# EAGLE design wicon3d_hw (EAGLE 7.6.0)
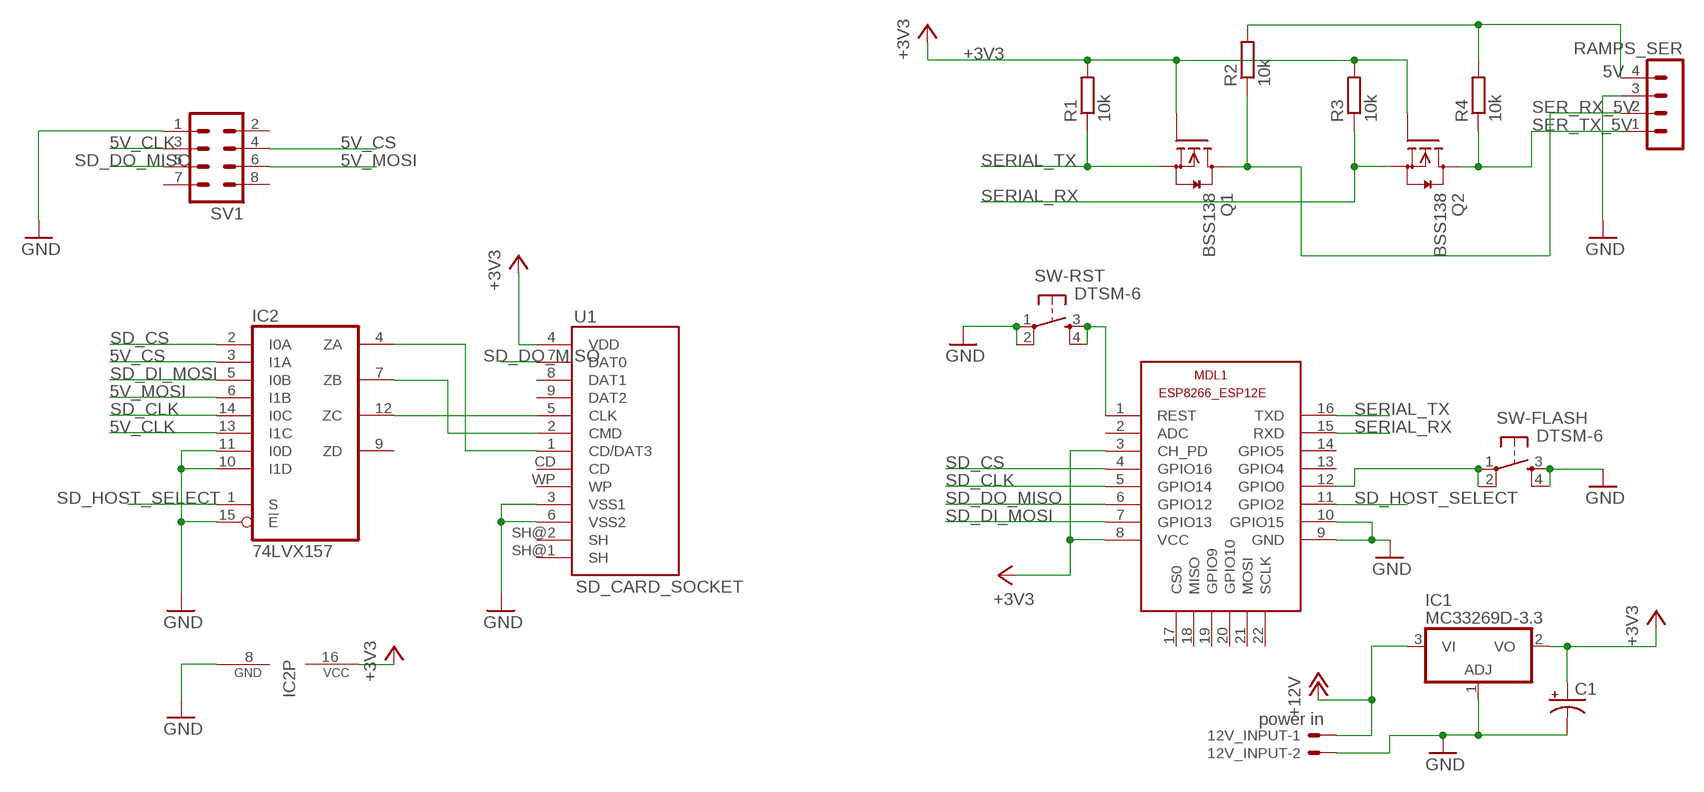
[diagram p0: schematic, sheet 1]

## Parts
12V_INPUT  power in  22-23-2021  [22-23-2021]
C1  47UF-50V-20%(ELECT)  [PANASONIC_D]
IC1  MC33269D-3.3  [DPACK]
IC2  74LVX157  [TSSOP16L]
MDL1  ESP8266-12EESP8266-ESP12E  [ESP8266-ESP12E]
Q1  BSS138  [SOT23]
Q2  BSS138  [SOT23]
R1  10k  R-EU_R0805  [R0805]
R2  10k  R-EU_R0805  [R0805]
R3  10k  R-EU_R0805  [R0805]
R4  10k  R-EU_R0805  [R0805]
RAMPS_SER  MA04-1  [MA04-1]
SV1  MA04-2  [MA04-2]
SW-FLASH  DTSM-6  [DTSM-6]
SW-RST  DTSM-6  [DTSM-6]
U1  SD_CARD_SOCKET  [SD_1:1]

## Nets
5V: R2.2 R4.2 RAMPS_SER.4
5V_CLK: IC2.13(I1C) SV1.3
5V_CS: IC2.3(I1A) SV1.4
5V_MOSI: IC2.6(I1B) SV1.6
+3V3: C1.+ IC1.2(VO) IC2.16(VCC) MDL1.3(CH_PD) MDL1.8(VCC) Q1.1(G) Q2.1(G) R1.2 R3.2 U1.4(VDD)
+12V: 12V_INPUT.1 IC1.3(VI)
CLK: IC2.12(ZC) U1.5(CLK)
CS: IC2.4(ZA) U1.1(CD/DAT3)
GND: 12V_INPUT.2 C1.- IC1.1(ADJ) IC2.8(GND) IC2.10(I1D) IC2.11(I0D) IC2.15(!E) MDL1.9(GND) MDL1.10(GPIO15) RAMPS_SER.3 SV1.1 SW-FLASH.3 SW-FLASH.4 SW-RST.1 SW-RST.2 U1.3(VSS1) U1.6(VSS2)
MOSI: IC2.7(ZB) U1.2(CMD)
N$1: MDL1.1(REST) SW-RST.3 SW-RST.4
N$2: MDL1.12(GPIO0) SW-FLASH.1 SW-FLASH.2
N$5: MDL1.20(GPIO10) MDL1.21(MOSI) MDL1.22(SCLK)
SD_CLK: IC2.14(I0C) MDL1.5(GPIO14)
SD_CS: IC2.2(I0A) MDL1.4(GPIO16)
SD_DI_MOSI: IC2.5(I0B) MDL1.7(GPIO13)
SD_DO_MISO: MDL1.6(GPIO12) SV1.5 U1.7(DAT0)
SD_HOST_SELECT: IC2.1(S) MDL1.11(GPIO2)
SER_RX_5V: Q1.3(D) R2.1 RAMPS_SER.2
SER_TX_5V: Q2.3(D) R4.1 RAMPS_SER.1
SERIAL_RX: MDL1.15(RXD) Q2.2(S) R3.1
SERIAL_TX: MDL1.16(TXD) Q1.2(S) R1.1
Unconnected: IC2.9(ZD) MDL1.2(ADC) MDL1.13(GPIO4) MDL1.14(GPIO5) MDL1.17(CS0) MDL1.18(MISO) MDL1.19(GPIO9) SV1.2 SV1.7 SV1.8 U1.8(DAT1) U1.9(DAT2) U1.CD U1.SH@1(SH) U1.SH@2(SH) U1.WP

## Library data of the parts
12V_INPUT = con-molex:22-23-2021: .100" (2.54mm) Center Header - 2 Pin; MF: MOLEX; MPN: 22-23-2021; OC_FARNELL: 1462926; OC_NEWARK: 25C3832
C1 = SparkFun-Capacitors:47UF-50V-20%(ELECT): CAP-10547; PROD_ID: CAP-10547
IC1 = linear:MC33269?*: Adjustable Output Low Dropout Voltage Regulator 800 mA Source: http://www.onsemi.com/pub/Collateral/MC33269-D.PDF
IC2 = fairchild-semic:74LVX157: Low Voltage Quad 2-Input Multiplexer
MDL1 = ESP12E:ESP8266-12E: ESP8266-12E with additional I/O and GPIO04/05 corrected The author cannot warrant that this library is free from error or will meet your specific requirements. Created by PuceBaboon.com. Komagane, Nagano, JAPAN
Q1 Q2 = m-pad-2.1:BSS138: Fairchild Semiconductors BSS138 N-Channel Logic Level Enhancement Mode Field Effect Transistor General Description: These N-Channel enhancement mode field effect transistors are produced using Fairchild's proprietary, high cell density, DMOS technology. These products have been designed to minimize on-state resistance while provide rugged, reliable, and fast switching performance.These products are particularly suited for low voltage, low current applications such as small servo motor control, power MOSFET gate drivers, and other switching applications. Features: 0.22 A, 50 V. RDS(ON) = 3.5Ohm @ VGS = 10 V RDS(ON) = 6.0Ohm @ VGS = 4.5 V High density cell design for extremely low RDS(ON) Rugged and Reliable Compact industry standard SOT-23 surface mount package Please send any comments to: messi@users.sourceforge.net
R1-R4 = resistor:R-EU_: RESISTOR, European symbol
RAMPS_SER = con-lstb:MA04-1: PIN HEADER; OC_FARNELL: unknown; OC_NEWARK: unknown
SV1 = con-lstb:MA04-2: PIN HEADER; OC_FARNELL: unknown; OC_NEWARK: unknown
SW-FLASH SW-RST = switch-tact:DTSM-6
U1 = SparkFun-Connectors:SD_CARD_SOCKET: SD Memory Card Connector, push-push normal type, CD enable, WP enable

## Board
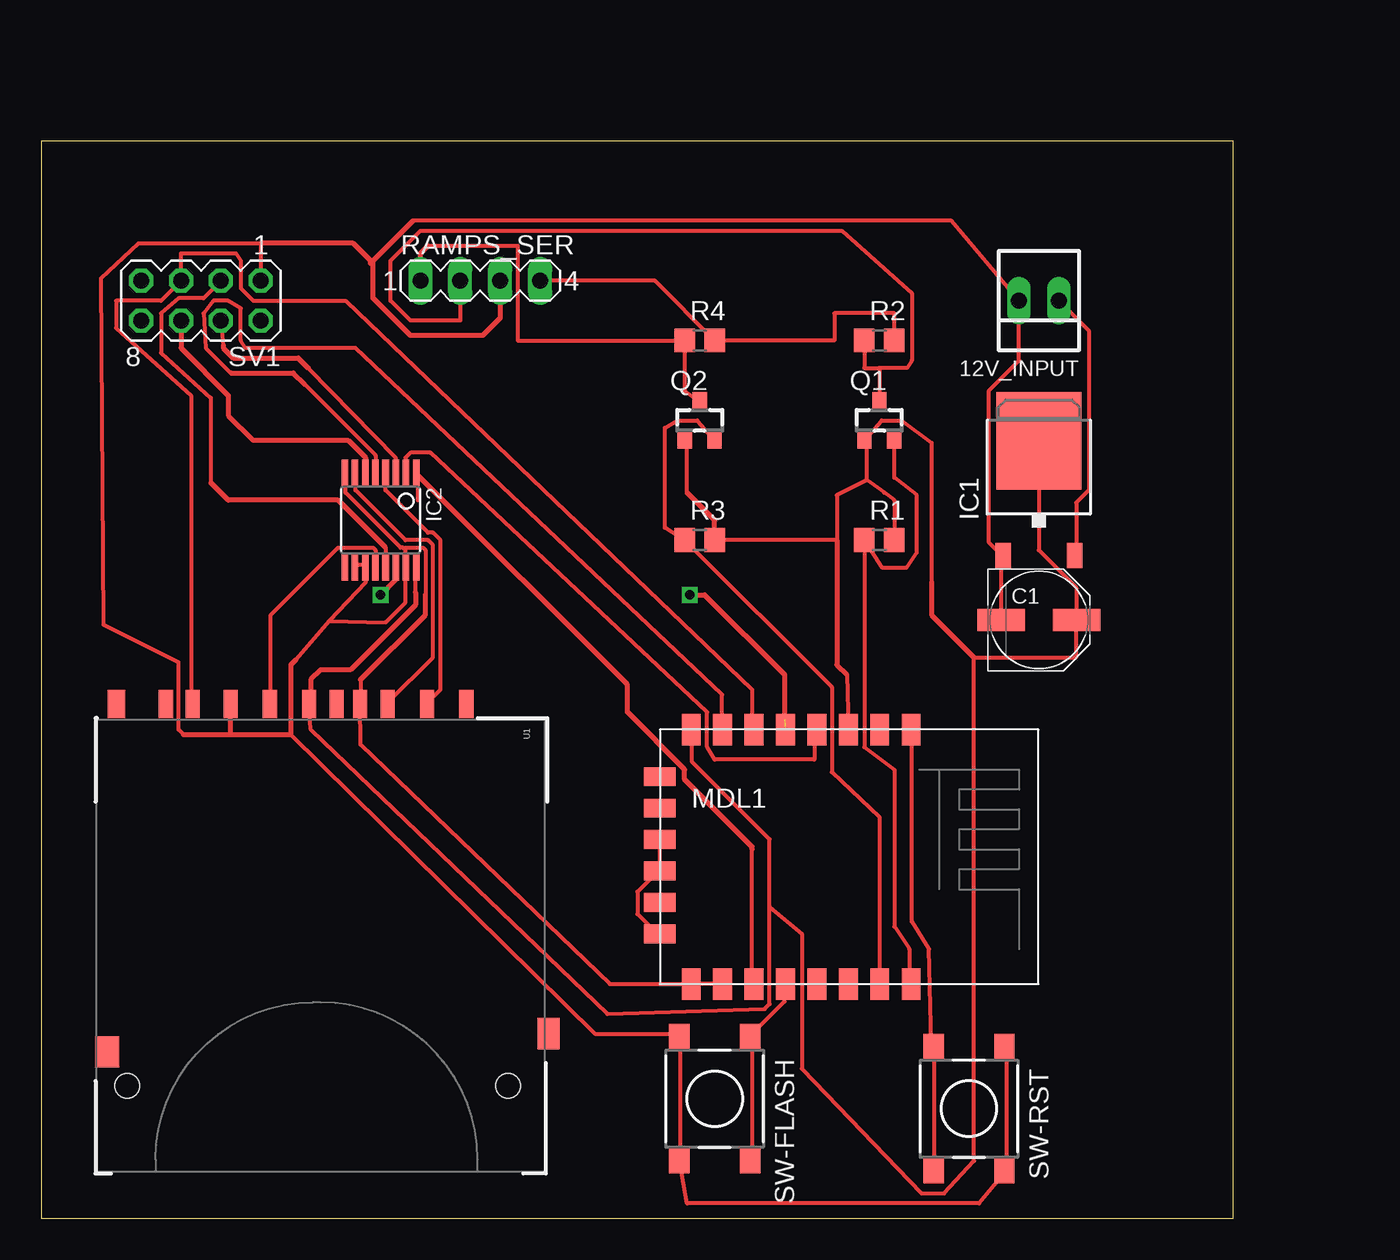
[diagram p1: board, top side]
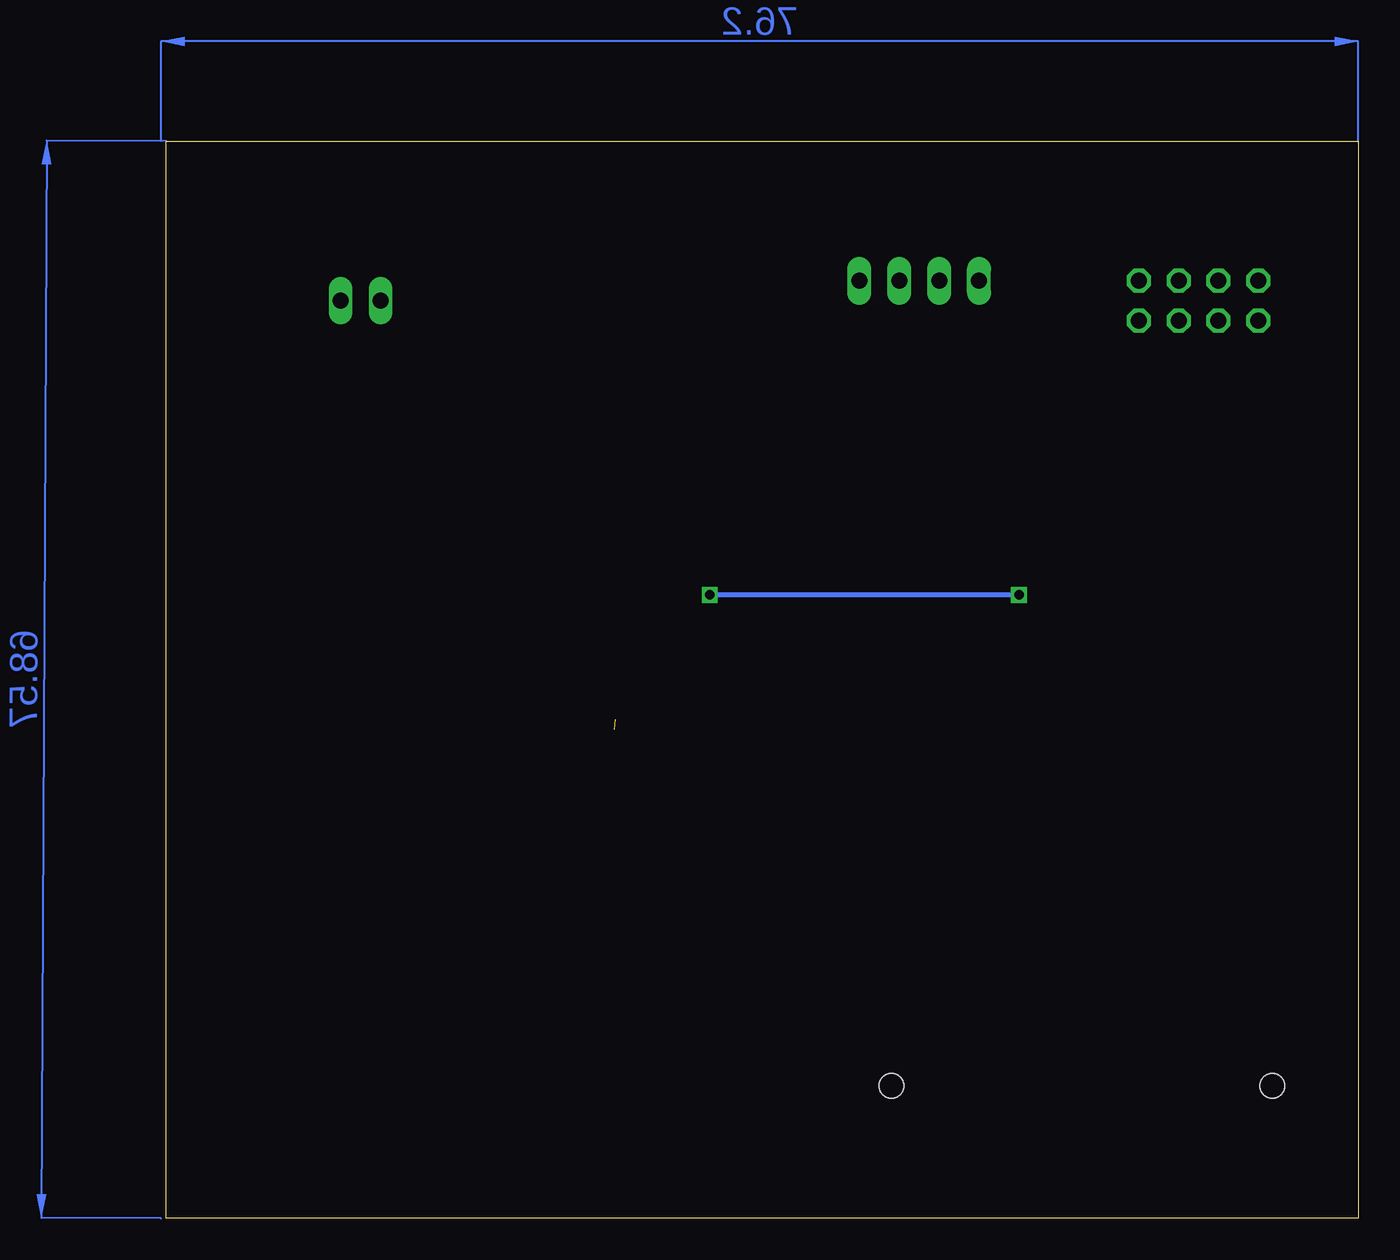
[diagram p2: board, bottom side, seen from below]

Size 75.87 x 68.57 mm. Coordinates in mm from the lower left corner, seen from the top.
Outline: 0,0 75.87,0 75.87,68.57 0,68.57 0,0
Copper layers (1*16): Top 0.035mm / dielectric 1.5mm / Bottom 0.035mm
Design rules "default": minimum track width 10mil, minimum drill 24mil, track to track 8mil, track to pad 8mil, pad to pad 8mil, via to via 8mil, smd to smd 8mil, copper to edge 40mil, drill to drill 8mil, minimum pad ring 10mil, minimum via ring 8mil, stop-mask expansion 4mil, vias tented up to drill 0mil, thermal gap 10mil

### Footprints (pad centres in the part's own frame; a part is rotated, then mirrored left to right if it is on the bottom)
22-23-2021 = drill 1 long: 1 -1.27,0; 2 1.27,0
PANASONIC_D = smd 3 x 1.4: + 2.4,0; - -2.4,0
DPACK = smd 1 x 1.6: 1 -2.28,-4.8; 3 2.28,-4.8 | smd 5.4 x 6.2: 2 0,2.5
TSSOP16L = smd 0.42 x 1.78: 1 -2.275,-2.97; 2 -1.625,-2.97; 3 -0.975,-2.97; 4 -0.325,-2.97; 5 0.325,-2.97; 6 0.975,-2.97; 7 1.625,-2.97; 8 2.275,-2.97; 9 2.275,2.97; 10 1.625,2.97; 11 0.975,2.97; 12 0.325,2.97; 13 -0.325,2.97; 14 -0.975,2.97; 15 -1.625,2.97; 16 -2.275,2.97
ESP8266-ESP12E = smd 2 x 1.2: 1 0,16; 2 0,14; 3 0,12; 4 0,10; 5 0,8; 6 0,6; 7 0,4; 8 0,2; 9 16.2,2; 10 16.2,4; 11 16.2,6; 12 16.2,8; 13 16.2,10; 14 16.2,12; 15 16.2,14; 16 16.2,16 | smd 1.2 x 2: 17 11,0; 18 3,0; 19 5,0; 20 13,0; 21 7,0; 22 9,0
SOT23 = smd 0.9 x 1.2: 1 -0.95,-1.2; 2 0.95,-1.2; 3 0,1.2
R0805 = smd 1.3 x 1.5: 1 -0.95,0; 2 0.95,0
MA04-1 = drill 1.016 long: 1 -3.81,0; 2 -1.27,0; 3 1.27,0; 4 3.81,0
MA04-2 = drill 1.016 octagon: 1 -3.81,-1.27; 2 -3.81,1.27; 3 -1.27,-1.27; 4 -1.27,1.27; 5 1.27,-1.27; 6 1.27,1.27; 7 3.81,-1.27; 8 3.81,1.27
DTSM-6 = smd 1.55 x 1.3: 1 -3.975,2.25; 2 3.975,2.25; 3 -3.975,-2.25; 4 3.975,-2.25
SD_1:1 = smd 1.8 x 0.9: 1 -1,6.77; 2 -1,4.27; 3 -1,2.52; 4 -1,-0.73; 5 -1,-3.23; 6 -1,-5.73; 7 -1,-8.15; 8 -1,-9.85; 9 -1,9.27; CD -1,1.02 | smd 2 x 1.4: SH@1 20,14.496 | smd 2 x 1.527: SH@2 21.15,-13.589 | smd 1.8 x 1.1: WP -1,-13 | hole 1.55: 23.3,11.94; 23.3,-12.32

### Placement (x,y rotation side)
12V_INPUT  63.5,58.42 180 top
C1  63.5,38.1 0 top
IC1  63.5,46.99 0 top
IC2  21.59,44.45 180 top
MDL1  39.37,31.11 270 top
Q1  53.34,50.8 0 top
Q2  41.91,50.8 0 top
R1  53.34,43.18 0 top
R2  53.34,55.88 0 top
R3  41.91,43.18 0 top
R4  41.91,55.88 0 top
RAMPS_SER  27.94,59.69 0 top
SV1  10.16,58.42 180 top
SW-FLASH  42.86,7.62 270 top
SW-RST  59.05,6.99 270 top
U1  17.78,31.75 270 top

### Tracks (layer width: path | path; a pad name or v marks a point on that pad's centre or on a via)
5V
  Top 0.254: R4.2 50.48,55.88 50.48,57.63 54.29,57.63 R2.2 | RAMPS_SER.4 39.05,59.69 R4.2 | R4.2
5V_CLK
  Top 0.254: 21.91,42.7 21.91,41.59 IC2.13 | 10.79,46.83 10.79,52.23 7.62,55.09 7.62,57.63 8.73,58.58 10.32,58.58 SV1.3
  Top 0.305: 21.91,42.7 18.89,45.72 11.91,45.72 10.79,46.83
5V_CS
  Top 0.254: 16.99,54.13 22.54,48.42 22.54,47.47 IC2.3 | SV1.4 11.59,55.56
  Top 0.305: 11.59,55.56 11.59,55.4 12.22,54.77 16.35,54.77 16.99,54.13
5V_MOSI
  Top 0.305: SV1.6 8.89,55.4 11.91,52.39 11.91,51.12 13.49,49.53 19.53,49.53 20.64,48.42 20.64,47.44 IC2.6
+3V3
  Top 0.254: 65.88,38.1 65.88,40.16 63.5,42.55 IC1.2 | 41.12,46.2 41.12,49.53 Q2.1 | 52.55,46.99 53.66,46.2 54.29,45.72 R1.2 | 52.55,46.99 52.55,49.53 Q1.1 52.55,49.69 53.5,50.8 54.77,50.8 56.67,49.37 56.67,40.48 | 52.55,46.99 50.64,46.04 50.64,43.18 R3.2 | 51.28,34.61 MDL1.3 | 65.88,38.1 65.88,35.72 59.37,35.72 59.37,3.65 57.47,1.59 56.04,1.59 48.42,9.53 48.42,18.1 46.35,19.84 | 65.88,38.1 C1.+ | 23.81,39.85 23.81,41.43 IC2.16 | 17.14,33.18 17.14,32.86 U1.4 17.14,31.11 36.04,13.02 46.04,13.34 46.35,13.65 46.35,19.84 | 46.35,19.84 46.35,24.13 41.43,29.05 41.43,31.11 MDL1.8
  Top 0.305: 23.81,39.85 23.81,39.05 19.68,34.92 17.78,34.92 17.14,34.29 17.14,32.84 U1.4 | R3.2 42.86,44.45 41.12,46.2 | 50.64,43.18 50.64,35.24 51.28,34.61 | 56.67,40.48 56.67,38.42 59.37,35.72
+12V
  Top 0.254: 12V_INPUT.1 66.67,56.52 66.67,46.35 65.88,45.56 65.88,42.23 IC1.3
CLK
  Top 0.254: IC2.12 21.27,41.59 21.27,42.55 21.11,42.7 18.89,42.7 14.61,38.42 14.61,32.86 U1.5
CS
  Top 0.254: IC2.4 21.91,47.31 21.91,46.35 24.61,43.66 24.92,43.66 25.4,43.18 25.4,33.66 24.61,32.86 U1.1
GND
  Top 0.254: C1.- 61.12,38.1 61.12,42.07 IC1.1 61.12,42.23 60.33,43.02 60.33,52.7 62.23,54.61 12V_INPUT.2 57.94,63.5 23.65,63.5 | SW-RST.1 61.44,10.95 61.44,3.02 SW-RST.2 61.28,2.86 59.69,0.95 41.12,0.95 40.64,3.49 SW-FLASH.4 40.64,3.65 40.64,11.59 SW-FLASH.3 40.48,11.75 35.24,11.75 15.88,30.8 | MDL1.10 43.34,14.92 41.43,14.92 MDL1.9 41.27,14.92 36.2,14.92 20.32,30.16 U1.3 20.32,32.86 20.32,34.29 | IC2.10 20,41.59 20.48,41.59 IC2.11 20.64,41.43 20.64,40.48 18.34,38.02 | 18.34,38.02 21.91,37.94 23.18,39.21 23.18,41.43 IC2.15 23.18,41.59 23.18,42.55 23.1,42.62 | 23.1,42.62 23.02,42.7 22.86,42.7 19.37,46.2 19.37,47.31 IC2.8 | 18.34,38.02 16.19,35.56 | 12.06,32.7 U1.6 | 24.45,39.69 24.45,42.55 24.29,42.7 23.18,42.7 23.1,42.62 | SV1.1 13.97,62.07 6.19,62.07 3.81,59.85 3.97,37.78 8.73,35.4 8.73,31.11 9.05,30.8
  Top 0.305: 20.32,34.29 24.45,38.42 24.45,39.69 | 9.05,30.8 12.06,30.8 | 12.06,30.8 12.06,32.73 U1.6 | 12.06,30.8 15.88,30.8 15.88,35.24 16.19,35.56 | 21.11,60.96 20.95,60.8 20.95,60.96 19.84,62.07 13.97,62.07 | 21.11,60.96 23.65,63.5 | RAMPS_SER.3 29.21,57.31 28.1,56.2 23.5,56.2 21.11,58.58 21.11,60.96
MOSI
  Top 0.254: IC2.7 20,47.31 20,46.35 23.18,43.18 24.61,43.18 24.92,42.86 24.92,35.72 22.07,32.86 U1.2
N$1
  Top 0.254: SW-RST.4 56.83,3.02 56.83,10.95 SW-RST.3 56.67,11.11 56.52,17.14 55.4,18.89 55.4,31.11 MDL1.1
N$2
  Top 0.254: SW-FLASH.2 45.24,3.65 45.24,11.59 SW-FLASH.1 45.24,11.75 47.31,13.81 47.31,14.76 MDL1.12
N$5
  Top 0.254: 39.37,22.23 37.94,20.8 37.94,19.37 39.05,18.26 39.37,18.26 MDL1.20 | 39.37,22.23 MDL1.21 | 39.37,22.23 MDL1.22
SD_CLK  (via drill 0.6)  (1 unrouted)
  Top 0.305: IC2.14 22.57,40.66 v21.59,39.69 | v41.27,39.69 42.23,39.69 47.31,34.61 47.31,31.75
  Bottom 0.305: v21.59,39.69 v41.27,39.69
SD_CS
  Top 0.254: IC2.2 23.18,47.47 23.18,48.42 23.5,48.74 24.77,48.74 42.39,32.23 42.39,30 42.86,29.21 49.21,29.21 49.21,31.11 MDL1.4
SD_DI_MOSI
  Top 0.254: 16.75,53.1 21.27,48.58 21.27,47.47 IC2.5 | 12.06,53.82 10.48,55.4 10.32,57.63 10.95,58.42 11.91,58.42 12.7,57.94 12.7,55.88 13.02,55.4 20,55.4 43.34,33.34 43.34,31.11 MDL1.7
  Top 0.305: 12.06,53.82 16.03,53.82 16.75,53.1
SD_DO_MISO
  Top 0.254: U1.7 9.53,32.86 9.53,52.39 4.76,56.67 4.76,58.42 7.62,58.42 SV1.5 8.89,61.44 12.38,61.44 12.7,60.96 12.7,59.21 13.49,58.42 19.37,58.42 45.24,33.66 45.24,31.11 MDL1.6
SD_HOST_SELECT
  Top 0.254: 23.97,45.72 23.97,47.31 IC2.1 | 45.24,23.5 45.24,14.92 MDL1.11
  Top 0.305: 45.24,23.5 45.24,23.65 40.96,27.94 40.96,28.57 37.31,32.23 37.31,33.98 IC2.1
SER_RX_5V
  Top 0.254: 53.34,54.13 52.39,54.13 R2.1 | 53.34,54.13 Q1.3 | 53.34,54.13 55.09,54.13 55.4,54.61 55.4,58.9 50.96,62.87 24.13,62.87 22.23,60.96 22.23,58.42 23.5,57.15 26.67,57.15 RAMPS_SER.2
SER_TX_5V
  Top 0.254: Q2.3 40.96,52.7 R4.1 | R4.1 30.32,55.88 30.32,61.91 24.61,61.91 | R4.1
  Top 0.305: RAMPS_SER.1 24.13,61.44 24.61,61.91
SERIAL_RX
  Top 0.254: R3.1 39.69,43.97 39.69,50.32 40.48,50.8 41.75,50.8 42.7,49.69 Q2.2 | R3.1 50.32,33.81 50.32,28.42 53.34,25.56 53.34,14.92 MDL1.15 | R3.1
SERIAL_TX
  Top 0.254: Q1.2 54.29,49.53 54.29,47.15 55.72,46.04 55.72,42.39 55.09,41.43 53.5,41.43 R1.1 52.39,43.02 52.39,30 54.29,28.57 54.29,18.57 55.24,17.14 55.24,14.92 MDL1.16
(copper drawn outside any net)
  shapes: Bottom area x2